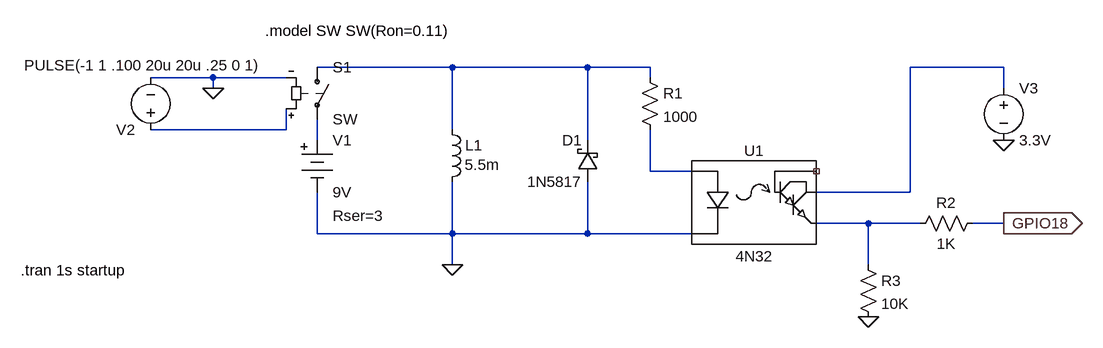
[diagram p0: schematic Doorbell_GPIO_Interface.asc]
Doorbell_GPIO_Interface.asc, the LTspice schematic file:
Version 4
SHEET 1 1236 680
WIRE 240 64 32 64
WIRE 448 64 240 64
WIRE 544 64 448 64
WIRE 1088 64 944 64
WIRE -128 80 -224 80
WIRE -16 80 -128 80
WIRE 544 80 544 64
WIRE -128 96 -128 80
WIRE 1088 96 1088 64
WIRE -16 160 -16 128
WIRE -16 160 -224 160
WIRE 240 160 240 64
WIRE 32 176 32 144
WIRE 448 176 448 64
WIRE 544 224 544 160
WIRE 608 224 544 224
WIRE 944 256 944 64
WIRE 944 256 800 256
WIRE 880 304 800 304
WIRE 960 304 880 304
WIRE 1088 304 1040 304
WIRE 32 320 32 256
WIRE 240 320 240 240
WIRE 240 320 32 320
WIRE 448 320 448 240
WIRE 448 320 240 320
WIRE 608 320 448 320
WIRE 240 368 240 320
WIRE 880 368 880 304
FLAG -128 96 0
FLAG 240 368 0
FLAG 1088 176 0
FLAG 880 448 0
FLAG 1088 304 GPIO18
IOPIN 1088 304 Out
SYMBOL Misc\\battery 32 160 R0
WINDOW 123 0 0 Left 0
WINDOW 39 24 132 Left 2
SYMATTR SpiceLine Rser=3
SYMATTR InstName V1
SYMATTR Value 9V
SYMBOL voltage -224 176 R180
WINDOW 3 12 131 Bottom 2
WINDOW 123 0 0 Left 0
WINDOW 39 0 0 Left 0
SYMATTR Value PULSE(-1 1 .100 20u 20u .25 0 1)
SYMATTR InstName V2
SYMBOL ind 224 144 R0
WINDOW 3 35 70 Left 2
SYMATTR Value 5.5m
SYMATTR InstName L1
SYMATTR SpiceLine Rser=6
SYMBOL 4N32 704 288 R0
WINDOW 3 1 67 Center 2
SYMATTR InstName U1
SYMBOL res 528 64 R0
SYMATTR InstName R1
SYMATTR Value 1000
SYMBOL sw 32 48 R0
SYMATTR InstName S1
SYMBOL voltage 1088 80 R0
WINDOW 123 0 0 Left 0
WINDOW 39 0 0 Left 0
SYMATTR InstName V3
SYMATTR Value 3.3V
SYMBOL res 1056 288 R90
WINDOW 0 0 56 VBottom 2
WINDOW 3 32 56 VTop 2
SYMATTR InstName R2
SYMATTR Value 1K
SYMBOL res 864 352 R0
SYMATTR InstName R3
SYMATTR Value 10K
SYMBOL schottky 464 240 R180
WINDOW 0 24 64 Left 2
WINDOW 3 24 0 Left 2
SYMATTR InstName D1
SYMATTR Value 1N5817
SYMATTR Description Diode
SYMATTR Type diode
TEXT -424 376 Left 2 !.tran 1s startup
TEXT -48 8 Left 2 !.model SW SW(Ron=0.11)

The netlist it stands for:
* Doorbell_GPIO_Interface.asc
V1 N004 0 9V Rser=3
V2 N003 0 PULSE(-1 1 .100 20u 20u .25 0 1)
L1 N001 0 5.5m Rser=6
XU1 N005 0 NC_01 N002 N006 4N32  ; pins A K B C E
R1 N001 N005 1000
S1 N001 N004 N003 0 SW
V3 N002 0 3.3V
R2 GPIO18 N006 1K
R3 N006 0 10K
D1 0 N001 1N5817
.model D D
.lib standard.dio
.tran 1s startup
.model SW SW(Ron=0.11)
.lib 4N32.sub
.backanno
.end